# Altium schematic sheet [05] - MicroSD.SchDoc
size A4; DocumentNumber: 5; SheetNumber: 5; SheetTotal: 14
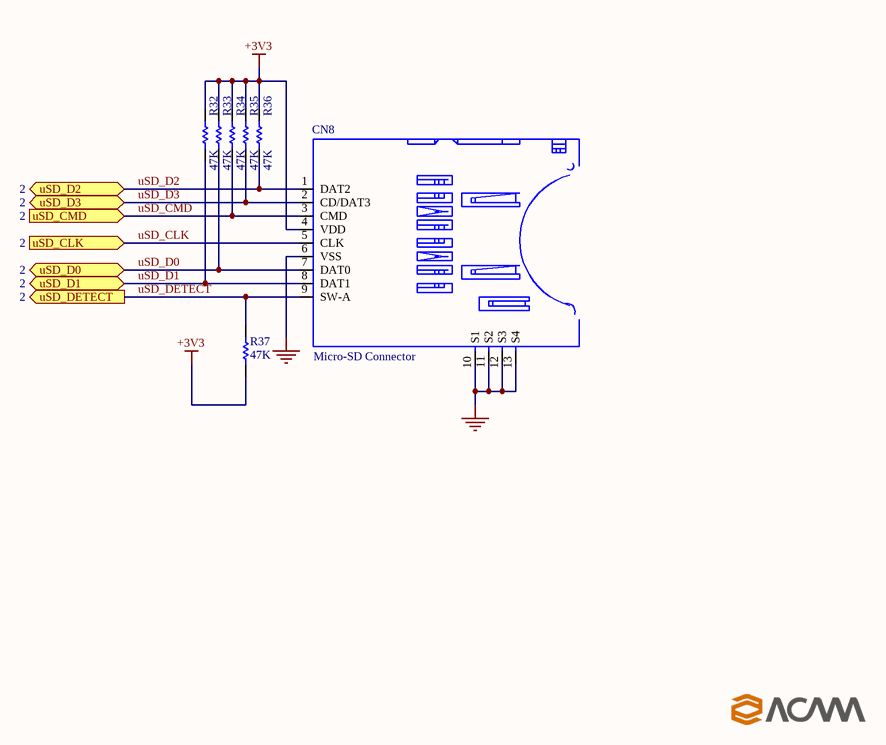
[diagram p0: [05] - MicroSD.SchDoc]

## Parts
CN8  Micro-SD Connector  [MICRO_SD_TFP-09-2-12B]
R32  47K  [0805_R]
R33  47K  [0805_R]
R34  47K  [0805_R]
R35  47K  [0805_R]
R36  47K  [0805_R]
R37  47K  [0805_R]

## Ports
uSD_CLK (in, see 2), uSD_CMD (in, see 2), uSD_D0 (bidir, see 2), uSD_D1 (bidir, see 2), uSD_D2 (bidir, see 2), uSD_D3 (bidir, see 2), uSD_DETECT (out, see 2)

## Nets
+3V3: CN8.4(VDD) R32.2 R33.2 R34.2 R35.2 R36.2 R37.1
GND: CN8.6(VSS) CN8.10(S1) CN8.11(S2) CN8.12(S3) CN8.13(S4)
uSD_CLK: CN8.5(CLK) ; port uSD_CLK
uSD_CMD: CN8.3(CMD) R34.1 ; port uSD_CMD
uSD_D0: CN8.7(DAT0) R33.1 ; port uSD_D0
uSD_D1: CN8.8(DAT1) R32.1 ; port uSD_D1
uSD_D2: CN8.1(DAT2) R36.1 ; port uSD_D2
uSD_D3: CN8.2(CD/DAT3) R35.1 ; port uSD_D3
uSD_DETECT: CN8.9(SW-A) R37.2 ; port uSD_DETECT

## Library data of the parts
CN8 = MicroSD_Connector #2: Javanelec 1.10mm Pitch microSD Memory Card Connector. Push-Push; Manufacturer Part Num: TFP-09-2-12B; Value: Micro-SD Connector
R32-R37 = Res SMD: SMD Resistor; Tolerance: 5%; Value: 47K; Manufacturer Part Num: *